# Altium project Ampli_RF.PrjPCB
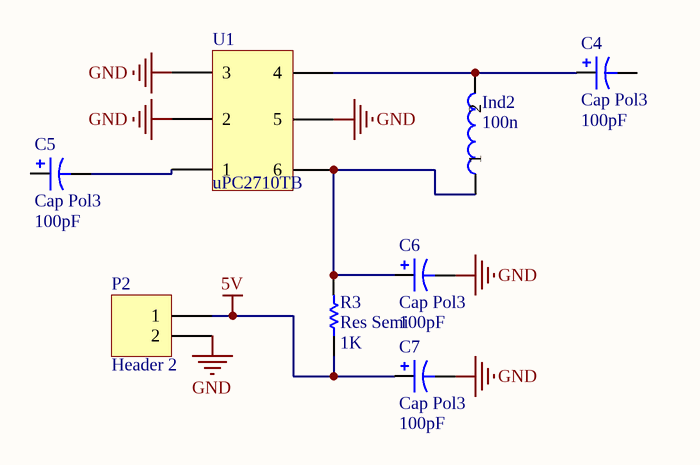
[diagram p0: UPC2710TB.SchDoc]
2 sheets, 16 parts. Net scope: global (net labels, ports and power ports of the same name join across sheets).
Board file: Ampli_RF.PcbDoc
Sheets:
  UPC2710TB.SchDoc
  MAR1SM.SchDoc

## Sheet UPC2710TB.SchDoc
size A4

### Parts
C4  Cap Pol3  value 100pF  [C0805]
C5  Cap Pol3  value 100pF  [C0805]
C6  Cap Pol3  value 100pF  [C0805]
C7  Cap Pol3  value 100pF  [C0805]
Ind2  Valor: 100n  [Ind_5mm]  (hidden comment: Ind2)
P2  Header 2  [HDR1X2]
R3  Res Semi  value 1K  [2012[0805]]
U1  uPC2710TB  [UPC2710TB2]

### Nets
5V: C7.1 P2.1 R3.1
GND: C6.2 C7.2 P2.2 U1.GND1(2) U1.GND2(3) U1.GND3(5)
NetC4_1: C4.1 Ind2.2 U1.RF_OUT(4)
NetC5_2: C5.2 U1.RF_IN(1)
NetC6_1: C6.1 Ind2.1 R3.2 U1.Vcc(6)

Not connected (* = marked no-connect by the designer): C4 2; C5 1

### Library data of the parts
C4-C7 = Cap Pol3: Polarized Capacitor (Surface Mount); Published: 8-Jun-2000; LatestRevisionDate: 17-Jul-2002; LatestRevisionNote: Re-released for DXP Platform.; PackageReference: C0805; Publisher: Altium Limited
P2 = Header 2: Header, 2-Pin; LatestRevisionDate: 17-Jul-2002; LatestRevisionNote: Re-released for DXP Platform.; Publisher: Altium Limited
R3 = Res Semi: Semiconductor Resistor; Published: 8-Jun-2000; LatestRevisionDate: 17-Jul-2002; LatestRevisionNote: Re-released for DXP Platform.; PackageReference: AXIAL-0.5; Publisher: Altium Limited
U1 = uPC2710TB: pin to pad: GND1>2 GND2>3 GND3>5 RF_IN>1 RF_OUT>4 Vcc>6

## Sheet MAR1SM.SchDoc
size A4
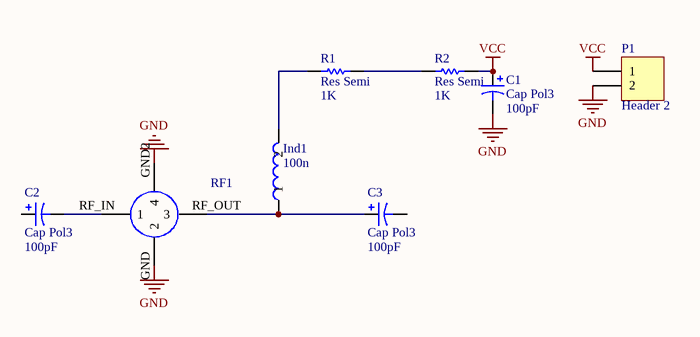
[diagram p1: MAR1SM.SchDoc]

### Parts
C1  Cap Pol3  value 100pF  [C0805]
C2  Cap Pol3  value 100pF  [C0805]
C3  Cap Pol3  value 100pF  [C0805]
Ind1  Valor: 100n  [IND_7MM]  (hidden comment: Ind2)
P1  Header 2  [HDR1X2]
R1  Res Semi  value 1K  [2012[0805]]
R2  Res Semi  value 1K  [2012[0805]]
RF1  *  [MAR-1]  (value not drawn)

### Nets
GND: C1.2 P1.2 RF1.GND(2) RF1.GND2(4)
VCC: C1.1 P1.1 R2.2
NetC2_2: C2.2 RF1.RF_IN(1)
NetC3_1: C3.1 Ind1.1 RF1.RF_OUT(3)
NetInd1_2: Ind1.2 R1.1
NetR1_2: R1.2 R2.1

Not connected (* = marked no-connect by the designer): C2 1; C3 2

### Library data of the parts
C1-C3 = Cap Pol3: Polarized Capacitor (Surface Mount); Published: 8-Jun-2000; LatestRevisionDate: 17-Jul-2002; LatestRevisionNote: Re-released for DXP Platform.; PackageReference: C0805; Publisher: Altium Limited
P1 = Header 2: Header, 2-Pin; LatestRevisionDate: 17-Jul-2002; LatestRevisionNote: Re-released for DXP Platform.; Publisher: Altium Limited
R1 R2 = Res Semi: Semiconductor Resistor; Published: 8-Jun-2000; LatestRevisionDate: 17-Jul-2002; LatestRevisionNote: Re-released for DXP Platform.; PackageReference: AXIAL-0.5; Publisher: Altium Limited
RF1 = MAR-1SM: pin to pad: GND>2 GND2>4 RF_IN>1 RF_OUT>3

## Nets that join several sheets
GND: UPC2710TB (6 pins), MAR1SM (C1.2 P1.2 RF1.GND RF1.GND2)